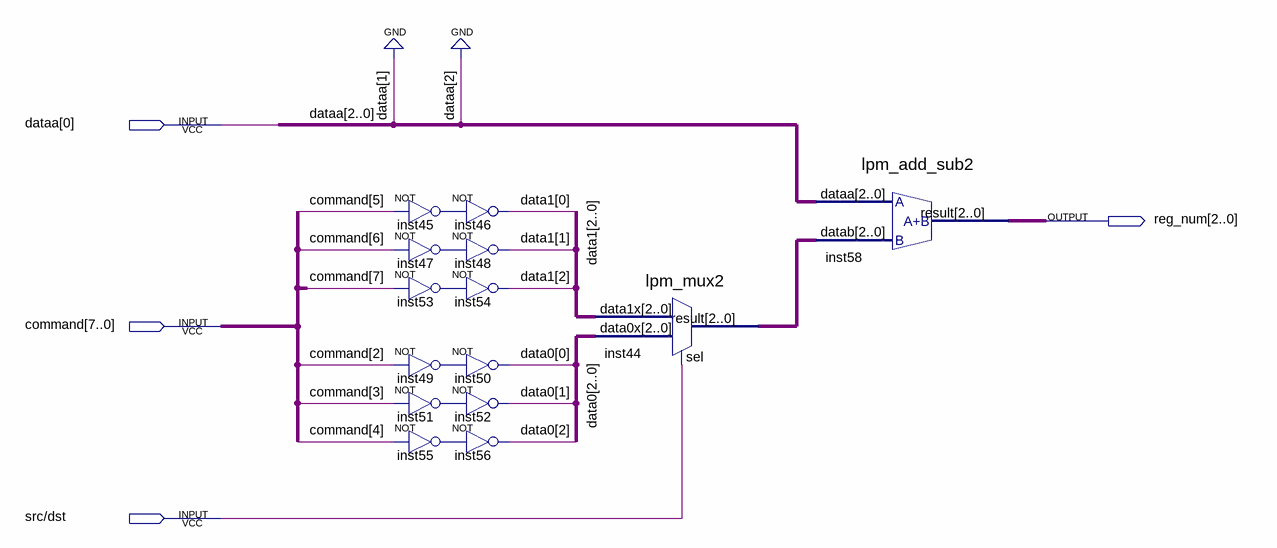
[diagram p0: schematic sheet]
// Quartus schematic decode_src_dst.bdf as structural Verilog: 14 symbols, 4 pins
module decode_src_dst (
  input  [0:0] dataa,
  input  [7:0] command,
  input  \src/dst ,
  output [2:0] reg_num
);

  wire inst45_out, inst47_out, inst49_out, inst51_out, inst53_out, inst55_out;
  wire [2:0] data0, data1, inst44_result;

  not inst45 (inst45_out, command[5]);
  not inst47 (inst47_out, command[6]);
  not inst53 (inst53_out, command[7]);
  not inst49 (inst49_out, command[2]);
  not inst51 (inst51_out, command[3]);
  not inst55 (inst55_out, command[4]);
  not inst46 (data1[0], inst45_out);
  not inst48 (data1[1], inst47_out);
  not inst54 (data1[2], inst53_out);
  not inst50 (data0[0], inst49_out);
  not inst52 (data0[1], inst51_out);
  not inst56 (data0[2], inst55_out);
  lpm_mux2 inst44 (.data1x(data1), .data0x(data0), .sel(\src/dst ), .result(inst44_result));
  lpm_add_sub2 inst58 (.dataa({2'b00, dataa[0]}), .datab(inst44_result), .result(reg_num));
endmodule
